# EAGLE schematic Pinduino-Nano-WPC-adaptor-panalized_2 (EAGLE 7.7.0)
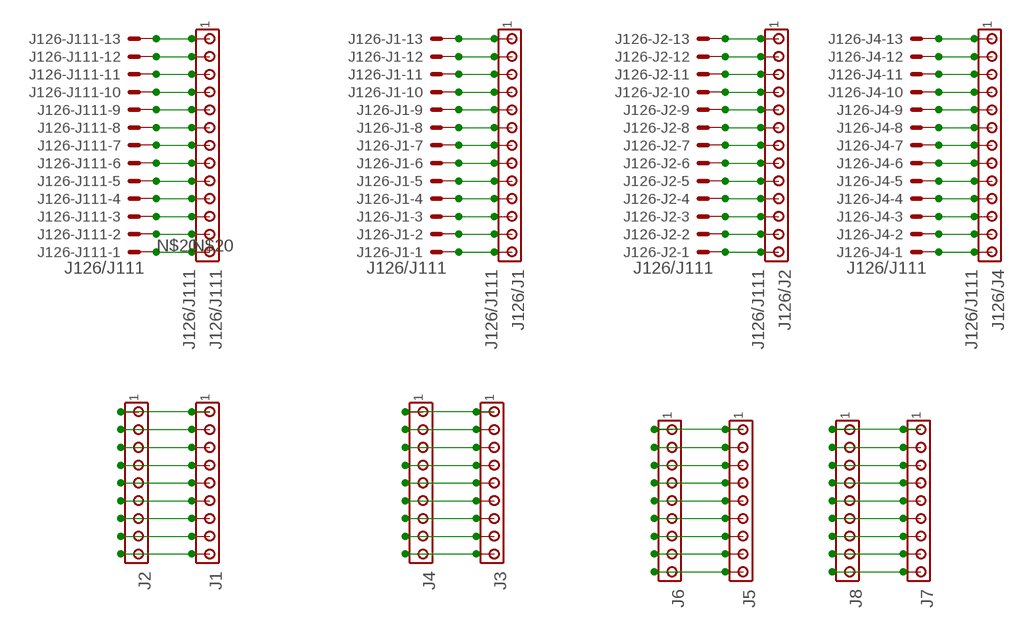
[diagram p0: schematic, sheet 1]

## Parts
J1  MTA09-156  [1X9MTA]
J2  MTA09-156  [1X9MTA]
J3  MTA09-156  [1X9MTA]
J4  MTA09-156  [1X9MTA]
J5  MTA09-156  [1X9MTA]
J6  MTA09-156  [1X9MTA]
J7  MTA09-156  [1X9MTA]
J8  MTA09-156  [1X9MTA]
J126-J1  J126/J111  KK-156-13  [KK-156-13]
J126-J2  J126/J111  KK-156-13  [KK-156-13]
J126-J4  J126/J111  KK-156-13  [KK-156-13]
J126-J111  J126/J111  KK-156-13  [KK-156-13]
J126/J1  J126/J111  MTA13-156  [1X13MTA]
J126/J2  J126/J111  MTA13-156  [1X13MTA]
J126/J4  J126/J111  MTA13-156  [1X13MTA]
J126/J111  J126/J111  MTA13-156  [1X13MTA]

## Nets
N$1: J126-J1.12 J126/J1.2
N$2: J126-J1.13 J126/J1.1
N$3: J126-J1.9 J126/J1.5
N$4: J126-J1.5 J126/J1.9
N$5: J126-J1.6 J126/J1.8
N$6: J126-J1.7 J126/J1.7
N$7: J126-J1.8 J126/J1.6
N$8: J126-J1.10 J126/J1.4
N$9: J126-J1.11 J126/J1.3
N$10: J126-J1.4 J126/J1.10
N$11: J126-J1.3 J126/J1.11
N$12: J126-J1.2 J126/J1.12
N$13: J126-J1.1 J126/J1.13
N$14: J126-J2.12 J126/J2.2
N$15: J126-J2.13 J126/J2.1
N$16: J126-J2.9 J126/J2.5
N$17: J126-J2.5 J126/J2.9
N$18: J126-J2.6 J126/J2.8
N$19: J126-J111.3 J126/J111.11
N$20: J126-J111.2 J126/J111.12
N$21: J126-J111.12 J126/J111.2
N$22: J126-J111.13 J126/J111.1
N$23: J126-J111.4 J126/J111.10
N$24: J126-J2.7 J126/J2.7
N$25: J126-J111.1 J126/J111.13
N$26: J126-J2.8 J126/J2.6
N$27: J126-J111.9 J126/J111.5
N$28: J126-J2.10 J126/J2.4
N$29: J126-J2.11 J126/J2.3
N$30: J126-J2.4 J126/J2.10
N$31: J126-J2.3 J126/J2.11
N$32: J126-J2.2 J126/J2.12
N$33: J126-J2.1 J126/J2.13
N$34: J1.1 J2.1
N$35: J1.2 J2.2
N$36: J1.3 J2.3
N$37: J1.4 J2.4
N$38: J1.5 J2.5
N$39: J1.6 J2.6
N$40: J1.7 J2.7
N$41: J1.8 J2.8
N$42: J1.9 J2.9
N$43: J3.1 J4.1
N$44: J3.2 J4.2
N$45: J3.3 J4.3
N$46: J3.4 J4.4
N$47: J126-J4.12 J126/J4.2
N$48: J126-J4.13 J126/J4.1
N$49: J126-J4.9 J126/J4.5
N$50: J126-J4.5 J126/J4.9
N$51: J126-J4.6 J126/J4.8
N$52: J126-J4.7 J126/J4.7
N$53: J126-J4.8 J126/J4.6
N$54: J126-J4.10 J126/J4.4
N$55: J126-J4.11 J126/J4.3
N$56: J126-J4.4 J126/J4.10
N$57: J126-J4.3 J126/J4.11
N$58: J126-J111.6 J126/J111.8
N$59: J126-J111.7 J126/J111.7
N$60: J126-J4.2 J126/J4.12
N$61: J126-J4.1 J126/J4.13
N$62: J126-J111.8 J126/J111.6
N$63: J3.5 J4.5
N$64: J126-J111.5 J126/J111.9
N$65: J126-J111.10 J126/J111.4
N$66: J126-J111.11 J126/J111.3
N$67: J3.6 J4.6
N$68: J3.7 J4.7
N$69: J3.8 J4.8
N$70: J3.9 J4.9
N$71: J5.1 J6.1
N$72: J5.2 J6.2
N$73: J5.3 J6.3
N$74: J5.4 J6.4
N$75: J5.5 J6.5
N$76: J5.6 J6.6
N$77: J5.7 J6.7
N$78: J5.8 J6.8
N$79: J5.9 J6.9
N$80: J7.1 J8.1
N$81: J7.2 J8.2
N$82: J7.3 J8.3
N$83: J7.4 J8.4
N$84: J7.5 J8.5
N$85: J7.6 J8.6
N$86: J7.7 J8.7
N$87: J7.8 J8.8
N$88: J7.9 J8.9

## Library data of the parts
J1-J8 = con-amp:MTA09-156: AMP connector
J126-J1 J126-J2 J126-J4 J126-J111 = con-molex:KK-156-13: KK 156 HEADER Source: http://www.molex.com/pdm_docs/sd/026604100_sd.pdf; OC_FARNELL: unknown; OC_NEWARK: unknown
J126/J1 J126/J2 J126/J4 J126/J111 = con-amp:MTA13-156: AMP connector

## Net classes
0 default: width 0.406 mm
1 Power: width 0.61 mm
2 GND: width 0.61 mm